# EAGLE design HDC2080_breakout_sch (EAGLE 9.1.3)
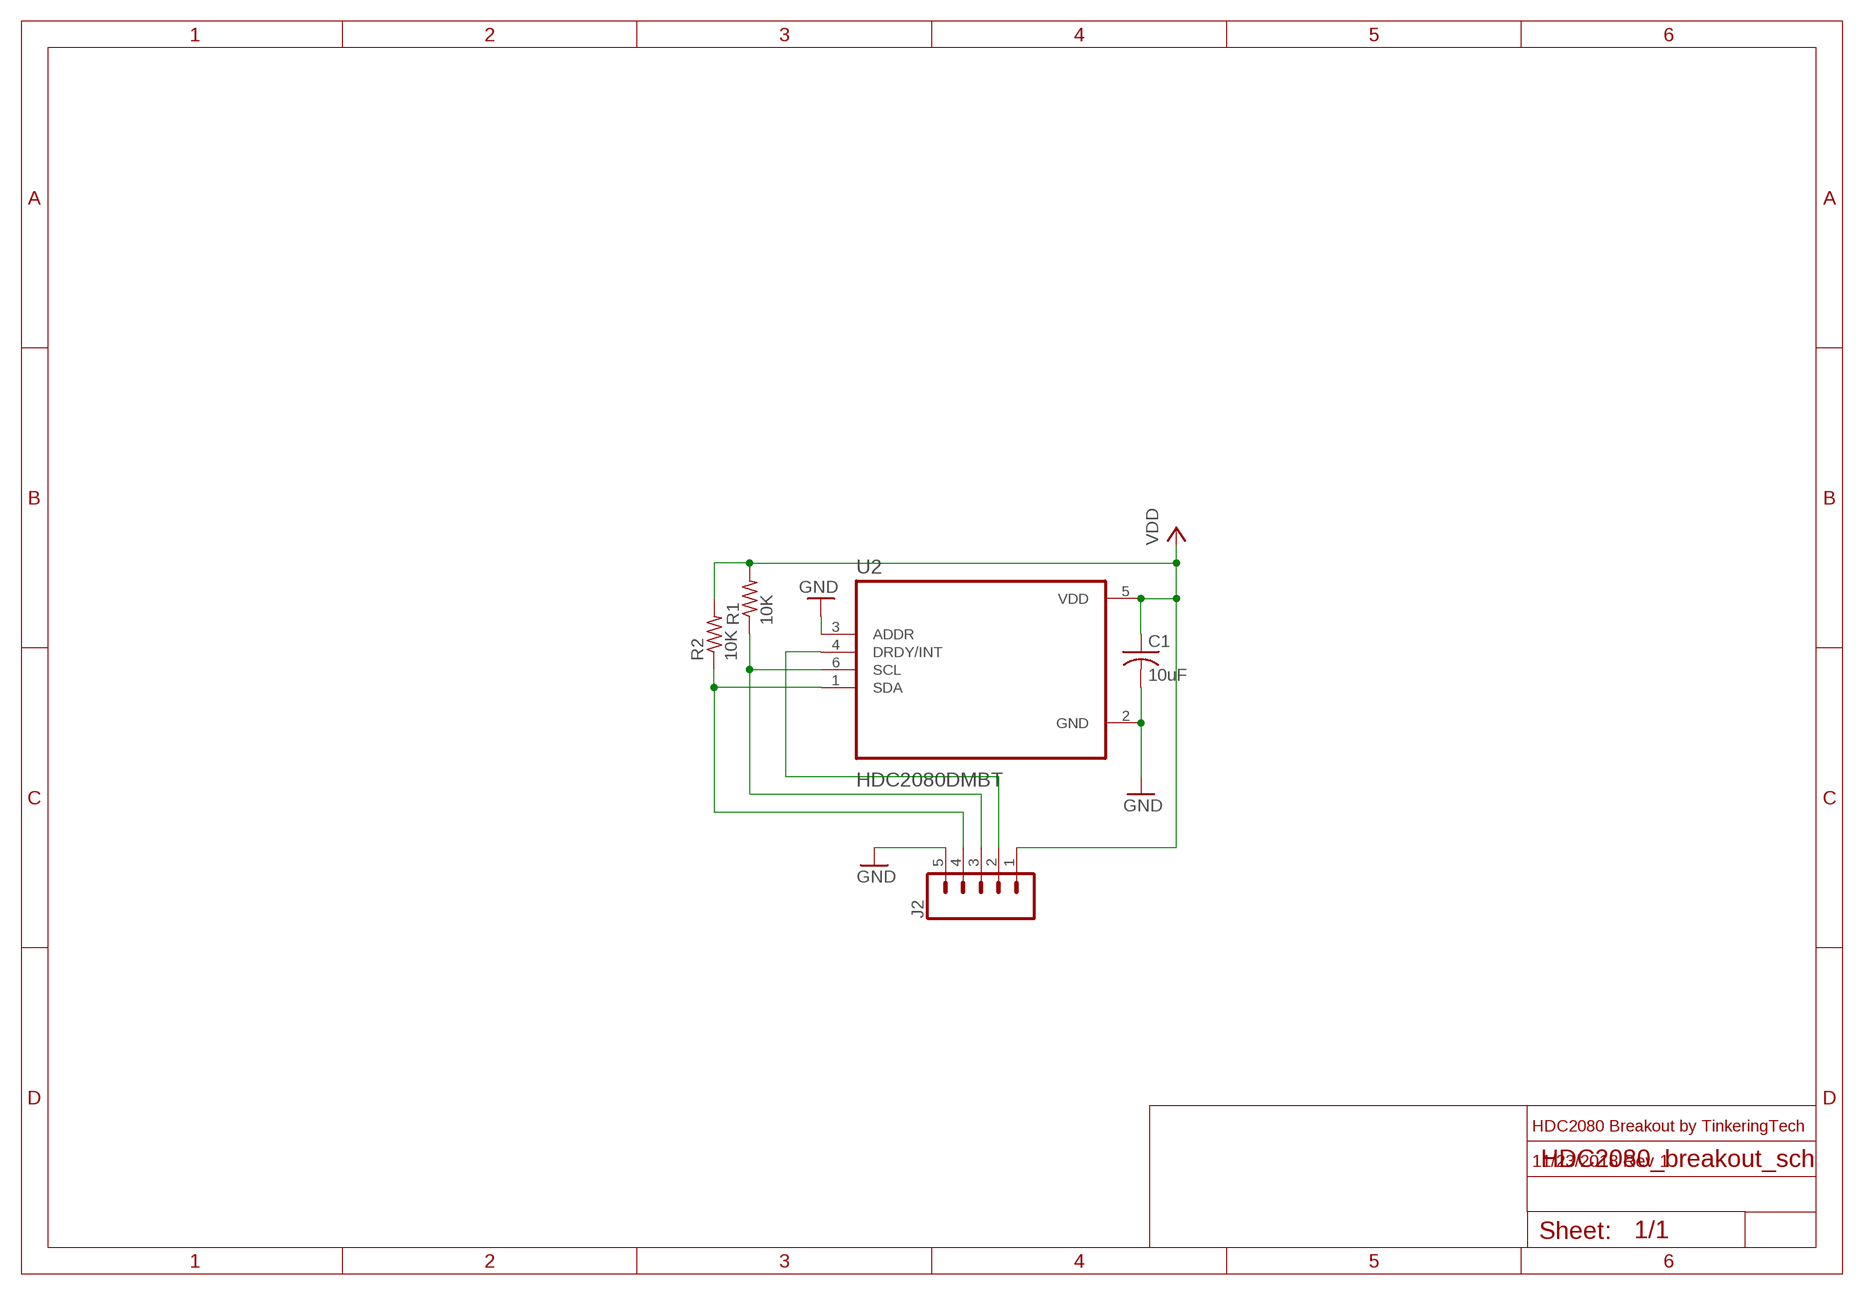
[diagram p0: schematic, sheet 1]

## Parts
C1  10uF  C-USC0402  [C0402]
J2  CONN_05  [1X05]
R1  10K  R-US_R0402  [R0402]
R2  10K  R-US_R0402  [R0402]
U2  HDC2080DMBT  [SON100P300X300X80-7N]

## Nets
GND: C1.2 J2.5 U2.2(GND) U2.3(ADDR)
N$1: J2.3 R1.1 U2.6(SCL)
N$2: J2.4 R2.1 U2.1(SDA)
N$3: J2.2 U2.4(DRDY/INT)
VCC: C1.1 J2.1 R1.2 R2.2 U2.5(VDD) ; supply symbol labelled VDD

## Notes on the sheet
- HDC2080 Breakout by TinkeringTech
- 11/23/2018 Rev 1

## Library data of the parts
C1 = adafruit:C-US: CAPACITOR, American symbol
J2 = SparkFun-Connectors:CONN_05: Multi connection point. Often used as Generic Header-pin footprint for 0.1 inch spaced/style header connections On any of the 0.1 inch spaced packages, you can populate with these: Break Away Headers - Straight <https://www.sparkfun.com/products/116> (PRT-00116) Break Away Male Headers - Right Angle <https://www.sparkfun.com/products/553> (PRT-00553) Female Headers <https://www.sparkfun.com/products/115> (PRT-00115) Break Away Headers - Machine Pin <https://www.sparkfun.com/products/117> (PRT-00117) Break Away Female Headers - Swiss Machine Pin <https://www.sparkfun.com/products/743> (PRT-00743) For SCREWTERMINALS and SPRING TERMINALS visit here: Screw Terimnals on SparkFun.com <https://www.sparkfun.com/search/results?term=Screw+Terminals> (5mm/3.5mm/2.54mm spacing) This device is also useful as a general connection point to wire up your design to another part of your project. Our various solder wires solder well into these plated through hole pads. Hook-Up Wire - Assortment (Stranded, 22 AWG) <https://www.sparkfun.com/products/11375> (PRT-11375) Hook-Up Wire - Assortment (Solid Core, 22 AWG) <https://www.sparkfun.com/products/11367> (PRT-11367) View the entire wire category on our website here <https://www.sparkfun.com/categories/141> Special notes: Molex polarized connector foot print use with SKU : PRT-08231 with associated crimp pins and housings. 1MM SMD Version SKU: PRT-10208
R1 R2 = resistor:R-US_: RESISTOR, American symbol
U2 = HDC2080DMBT:HDC2080DMBT: None; AVAILABILITY: Good; DESCRIPTION: Low Power Humidity and Temperature Digital Sensor 6-WSON -40 to 85; MF: Texas Instruments; MP: HDC2080DMBT; PACKAGE: WDFN-6 Texas Instruments; PRICE: 2.87 USD

## Board
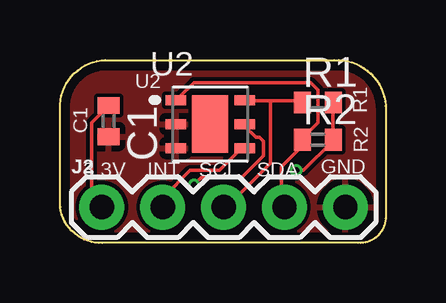
[diagram p1: board, top side]
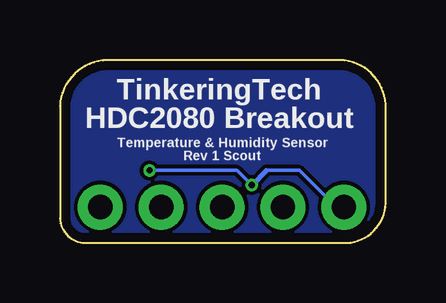
[diagram p2: board, bottom side, seen from below]

Size 13.59 x 7.62 mm. Coordinates in mm from the lower left corner, seen from the top.
Outline: 0,5.59 arc-90 1.91,7.62 11.43,7.62 arc-90 13.59,5.72 13.59,1.02 arc-90 12.45,0 1.78,0 arc-90 0,1.65 0,5.59
Copper layers (1*16): Top 0.035559375mm / dielectric 1.6mm / Bottom 0.035559375mm
Design rules "oshpark-2layer": minimum track width 6mil, minimum drill 10mil, track to track 6mil, track to pad 6mil, pad to pad 6mil, via to via 6mil, smd to smd 6mil, copper to edge 15mil, drill to drill 6mil, minimum pad ring 5mil, minimum via ring 5mil, stop-mask expansion 2.5mil, vias tented up to drill 0mil, thermal gap 10mil

### Footprints (pad centres in the part's own frame; a part is rotated, then mirrored left to right if it is on the bottom)
C0402 = smd 0.7 x 0.9: 1 -0.65,0; 2 0.65,0
1X05 = drill 1.016 pad 1.88: 1 0,0; 2 2.54,0; 3 5.08,0; 4 7.62,0; 5 10.16,0
R0402 = smd 0.7 x 0.9: 1 -0.65,0; 2 0.65,0
SON100P300X300X80-7N = smd 0.86 x 0.42: 1 -1.435,1; 2 -1.435,0; 3 -1.435,-1; 4 1.435,-1; 5 1.435,0; 6 1.435,1 | smd 1.5 x 2.4: 7 0,0

### Placement (x,y rotation side)
C1  2.03,5.08 270 top
J2  1.75,1.49 0 top
R1  10.76,5.86 0 top
R2  10.76,4.3 0 top
U2  6.27,4.95 0 top

### Tracks (layer width: path | path; a pad name or v marks a point on that pad's centre or on a via)
GND
  pour Top: 0,5.97 1.94,7.75 11.84,7.75 13.59,5.84 13.59,1.14 12.83,0.13 1.14,0.13 0,1.53
N$1
  Top 0.152: 8.79,5.92 10.01,5.92 R1.1 | 8.79,5.92 7.72,5.92 U2.6 | 8.79,5.92 8.79,3.33 6.96,1.5 J2.3
N$2
  Top 0.152: U2.1 4.98,6.07 5.59,6.68 10.46,6.68 10.77,6.38 10.77,5.01 10.16,4.4 R2.1 10.01,4.24 10.01,3.94 9.25,3.18 9.25,1.5 J2.4
N$3
  Top 0.152: U2.4 7.57,3.94 6.65,3.02 5.44,3.02 4.37,1.96 4.37,1.5 J2.2
VCC  (via drill 0.25)
  Top 0.152: R1.2 11.38,5.77 11.38,4.4 R2.2 11.38,4.24 10.16,3.02 v9.86,3.02 | v5.59,2.41 5.89,2.72 7.57,2.72 8.48,3.63 8.48,4.24 8.33,4.4 8.18,4.4 7.72,4.85 U2.5 | C1.1 1.93,5.61 1.32,5.01 1.32,1.8 1.63,1.5 J2.1
  Bottom 0.152: 4.98,3.02 3.61,3.02 2.08,1.5 1.78,1.5 J2.1 | v9.86,3.02 6.2,3.02 v5.59,2.41
  Bottom 0.203: 4.98,3.02 v5.59,2.41
VDD
  pour Bottom: 0,5.97 1.94,7.75 11.84,7.75 13.59,5.84 13.59,1.14 12.83,0.13 1.14,0.13 0,1.53

### Text on the board
bPlace: TinkeringTech / HDC2080 Breakout | Temperature & Humidity Sensor / Rev 1 Scout
_tsilk: U2 | R1 | C1 | R2 | 3.3V | INT | SCL | SDA | GND